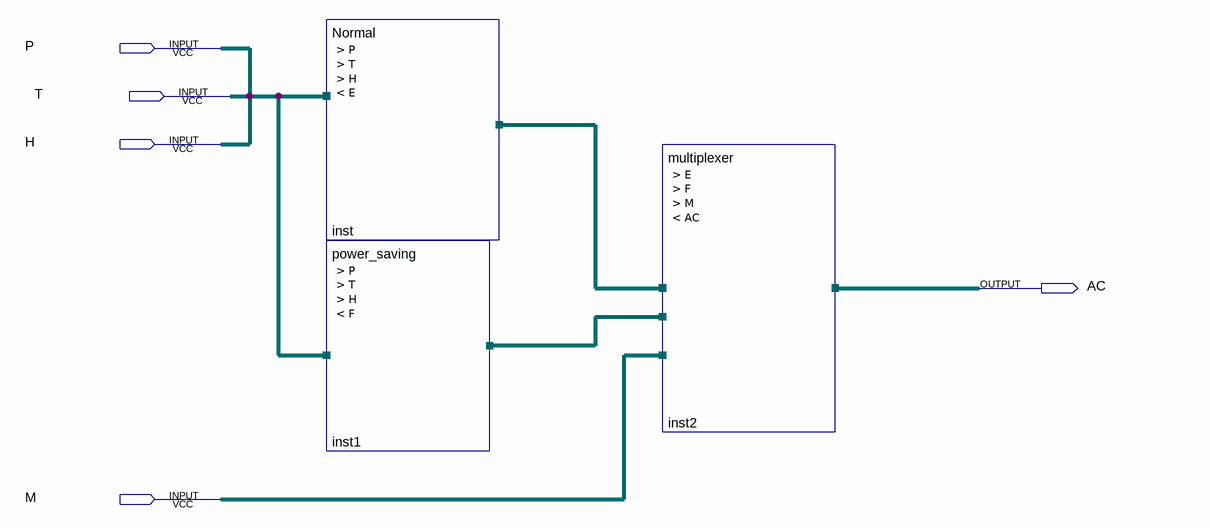
[diagram p0: schematic sheet]
// Quartus schematic lab04work.bdf as structural Verilog: 3 symbols, 5 pins
module lab04work (
  input  P,
  input  T,
  input  H,
  input  M,
  output AC
);

  wire E, F;

  Normal inst (.P(P), .T(T), .H(H), .E(E));
  power_saving inst1 (.P(P), .T(T), .H(H), .F(F));
  multiplexer inst2 (.E(E), .F(F), .M(M), .AC(AC));
endmodule
